# Altium schematic sheet interlock.SchDoc: foxBMS BMS-Extension
size A3; DocumentNumber: 7; SheetNumber: 7; SheetTotal: 14; Author: Fraunhofer IISB foxBMS Team; REL-DATE: 2017-05-16; VERSION: 1.0.2; GateName_1: G$1; SymbolName_1: FRAME_B_L; LibraryName: foxBMS_BMS-Master_V1.00_A; DeviceSetName: FRAME_B_L; GateName_2: G$2; SymbolName_2: DOCFIELD; SheetDescription: Interlock Circuit
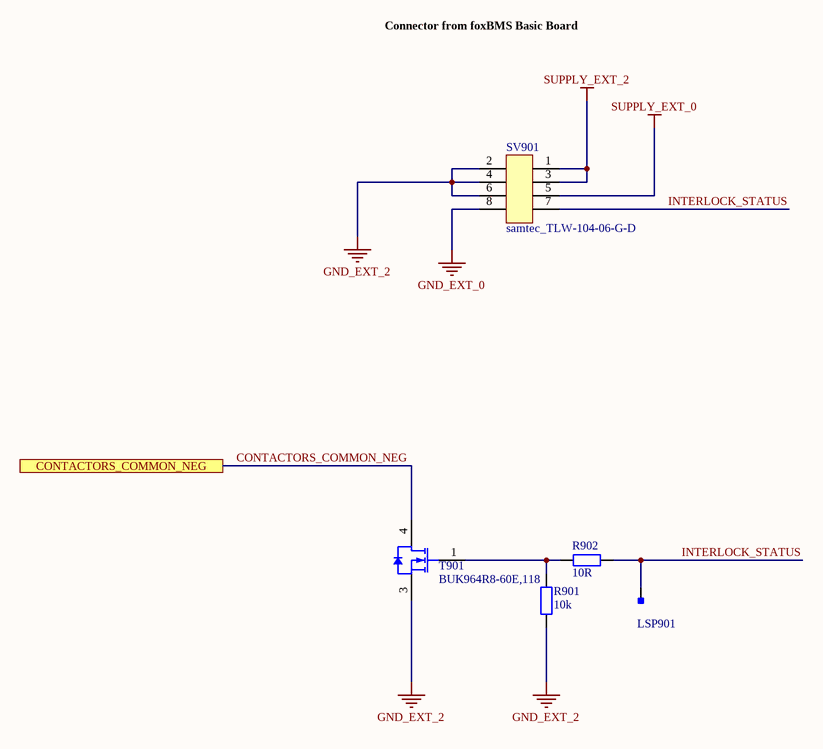
[diagram p0: interlock.SchDoc]

## Parts
LSP901  Testpoint_Square  [Testpoint_S1]  (value not drawn)  (no BOM)
R901  10k  [RESC1608X05N]
R902  10R  [RESC1608X05N]
SV901  samtec_TLW-104-06-G-D  [Pinheader_2.54_2x4]
T901  BUK964R8-60E,118  [NXP-SOT404_M]

## Ports
CONTACTORS_COMMON_NEG

## Nets
GND_EXT_0: SV901.8
GND_EXT_2: R901.2 SV901.2 SV901.4 SV901.6 T901.3(S)
SUPPLY_EXT_0: SV901.5
SUPPLY_EXT_2: SV901.1 SV901.3
CONTACTORS_COMMON_NEG: T901.4(D) ; port CONTACTORS_COMMON_NEG
INTERLOCK_STATUS: LSP901.1 R902.2 SV901.7
NetR901_1: R901.1 R902.1 T901.1(G)

## Notes on the sheet
- Connector from foxBMS Basic Board
- Fraunhofer IISB
- Schottkystr. 10
- developed by:
- 91058 Erlangen
- Germany
- Author
- Project
- License
- Description
- File
- Version
- Release Date
- Sheet
- www.foxbms.org
- www.iisb.fraunhofer.de
- foxBMS Team
- /

## Library data of the parts
LSP901 = Testpoint_Square: Testpoint, square; Part Number: Testpoint_Square
R901 = gen_R_10k_0603: SMD Resistor 10k 0603; Tolerance: 1%; Power: 0.1W; Case EIA: 0603; Case Metric: 1608; Maximum Working Voltage: 75V; PnP Package: R_0603; Part Number: gen_R_10k_0603; Operating Temperature: -55°C - +155°C; Resistance: 10k; Series: E24, E96; PnP Value: 10k; Supplier 1: Farnell; Supplier Part Number 1: 2073349
R902 = gen_R_10R_0603: SMD Resistor 10R 0603; Tolerance: 1%; Power: 0.1W; Case EIA: 0603; Case Metric: 1608; Maximum Working Voltage: 75V; PnP Package: R_0603; Part Number: gen_R_10R_0603; Operating Temperature: -55°C - +155°C; Resistance: 10R; Series: E24, E96; PnP Value: 10R; Supplier 1: Farnell; Supplier Part Number 1: 2073361
SV901 = samtec_TLW-104-06-G-D: Board-To-Board Connector, Vertical, Low Profile, 2.54 mm, 8 Contacts, Header, TLW Series, Through Hole, 2 Rows; Manufacturer: Samtec; Circuits: 8; Part Number: samtec_TLW-104-06-G-D; Part Name: TLW-104-06-G-D; Operating Temperature: -55°C - +125°C; Supplier 1: Digikey; Supplier Part Number 1: SAM1096-04-ND; ComponentLink1Description: Datasheet; ComponentLink1URL: http://suddendocs.samtec.com/catalog_english/tlw_th.pdf
T901 = CMP-1259-00124-1: N-Channel TrenchMOS Logic Level FET, 60 V, 100 A, 3-Pin SOT404, Tape and Reel; Manufacturer: NXP Semiconductors; Channel Type: N; ID [max] (A): 100; Automotive Qualified: Y; IDM [max] (A): 596; VGSth [typ] (V): 1.7; VDS [max] (V): 60; Packing: Tape & Reel; Qr [typ] (nC): 56; PackageDescription: 3-Pin Plastic Single-ended Surface Mounted Package, Body 10 x 9.6 mm, Pitch 2.54 mm; Mounting Technology: Surface Mount; ComponentLink3URL: http://www.nxp.com/documents/outline_drawing/sot404_po.pdf; ComponentLink1Description: Manufacturer URL; ComponentLink2URL: http://www.nxp.com/documents/data_sheet/BUK964R8-60E.pdf; PackageVersion: 13-02-25, 02/2013; ComponentLink2Description: Datasheet; PartNumber: BUK964R8-60E,118; ComponentLink1URL: http://www.nxp.com/; ComponentLink3Description: Package Specification; PackageReference: SOT404